# Altium schematic sheet 34.SchDoc
size 513 x 386 mm
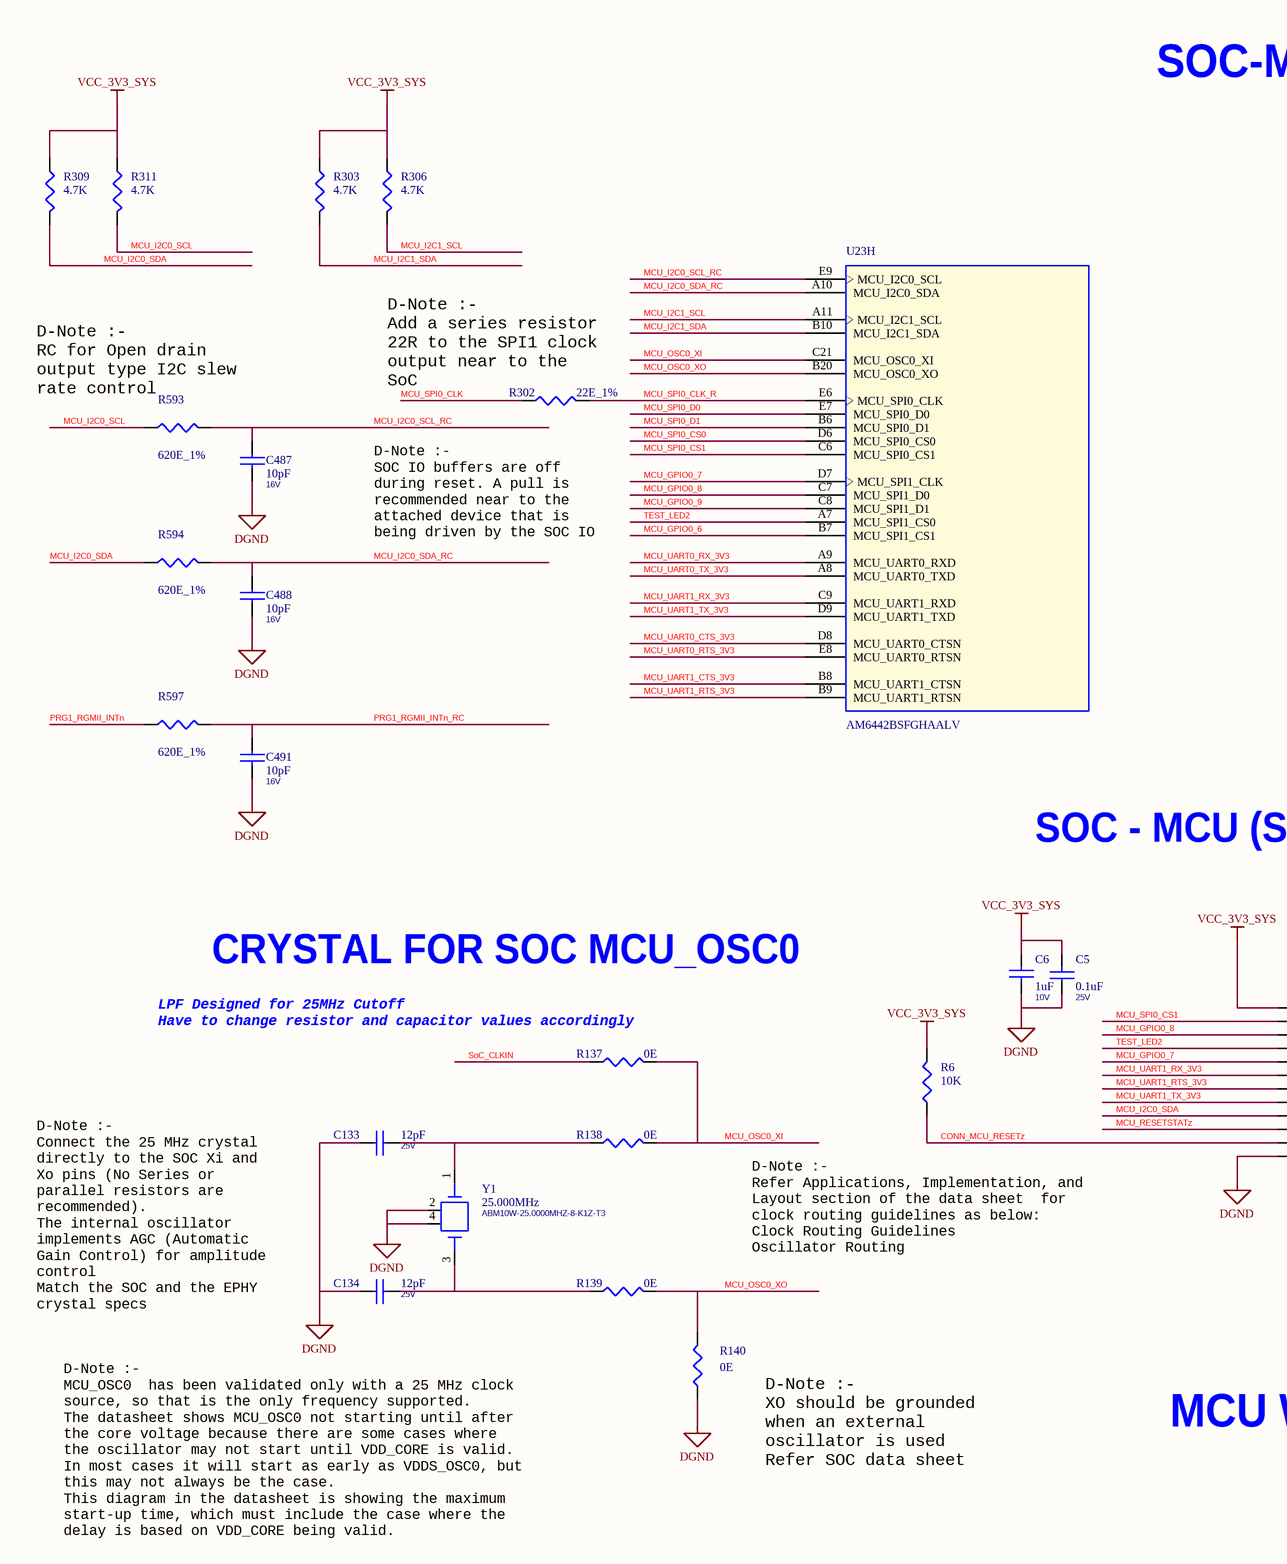
[diagram p0: 34.SchDoc, top left]
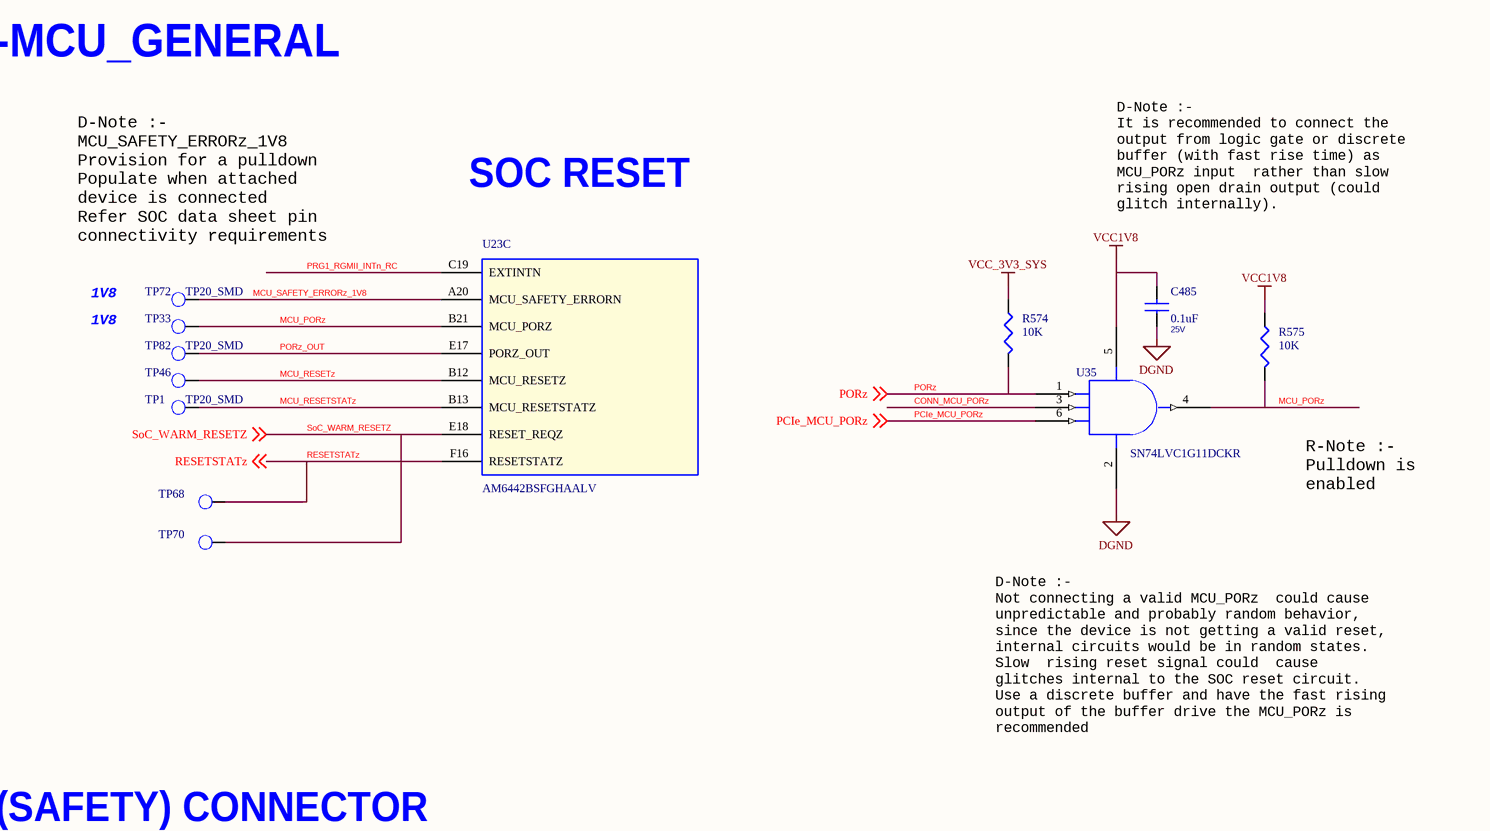
[diagram p1: 34.SchDoc, top right]
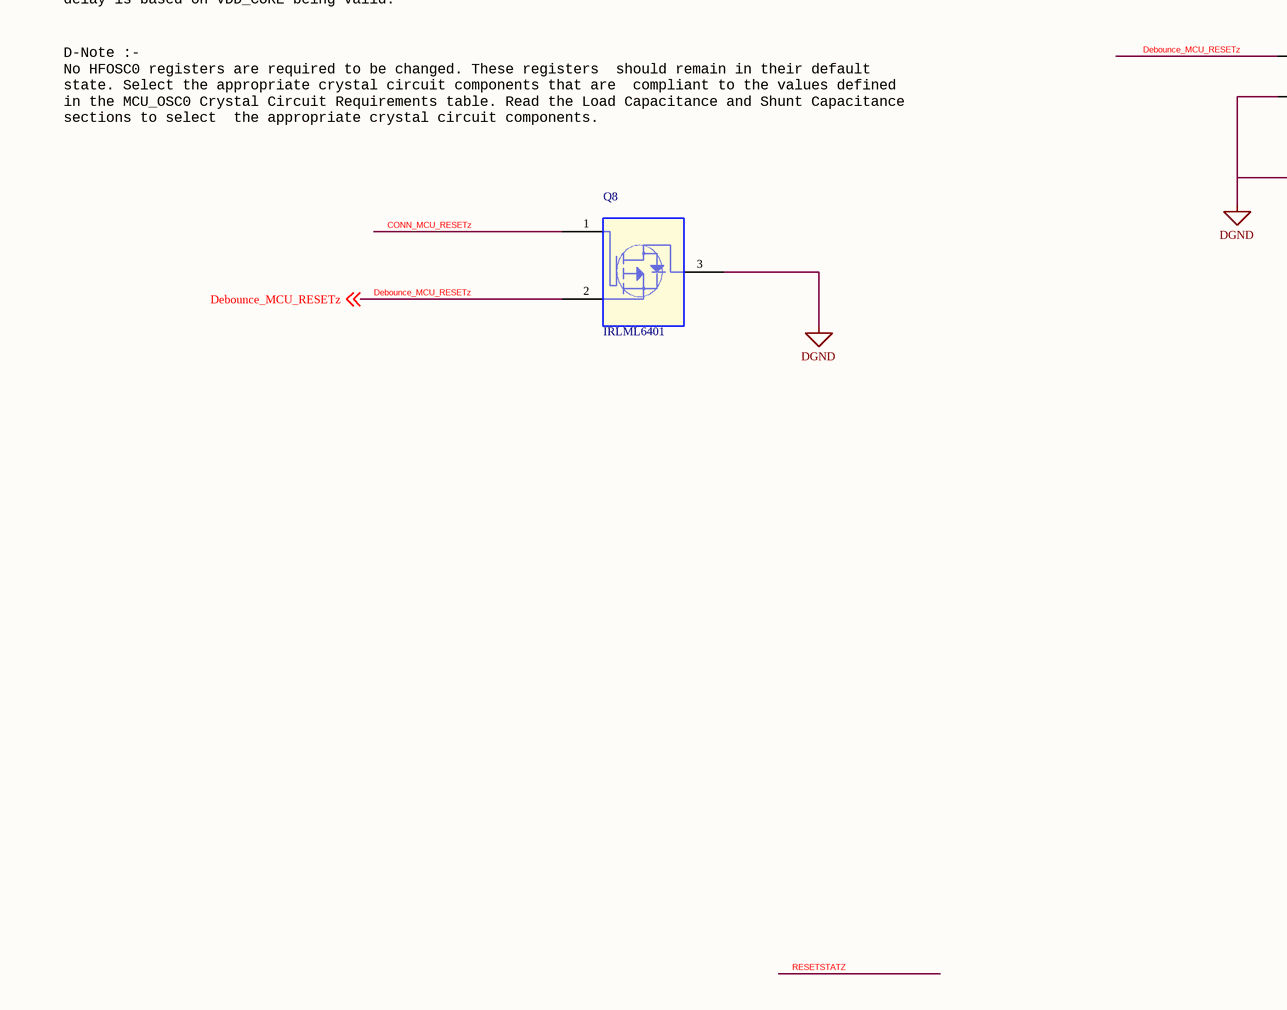
[diagram p2: 34.SchDoc, bottom left]
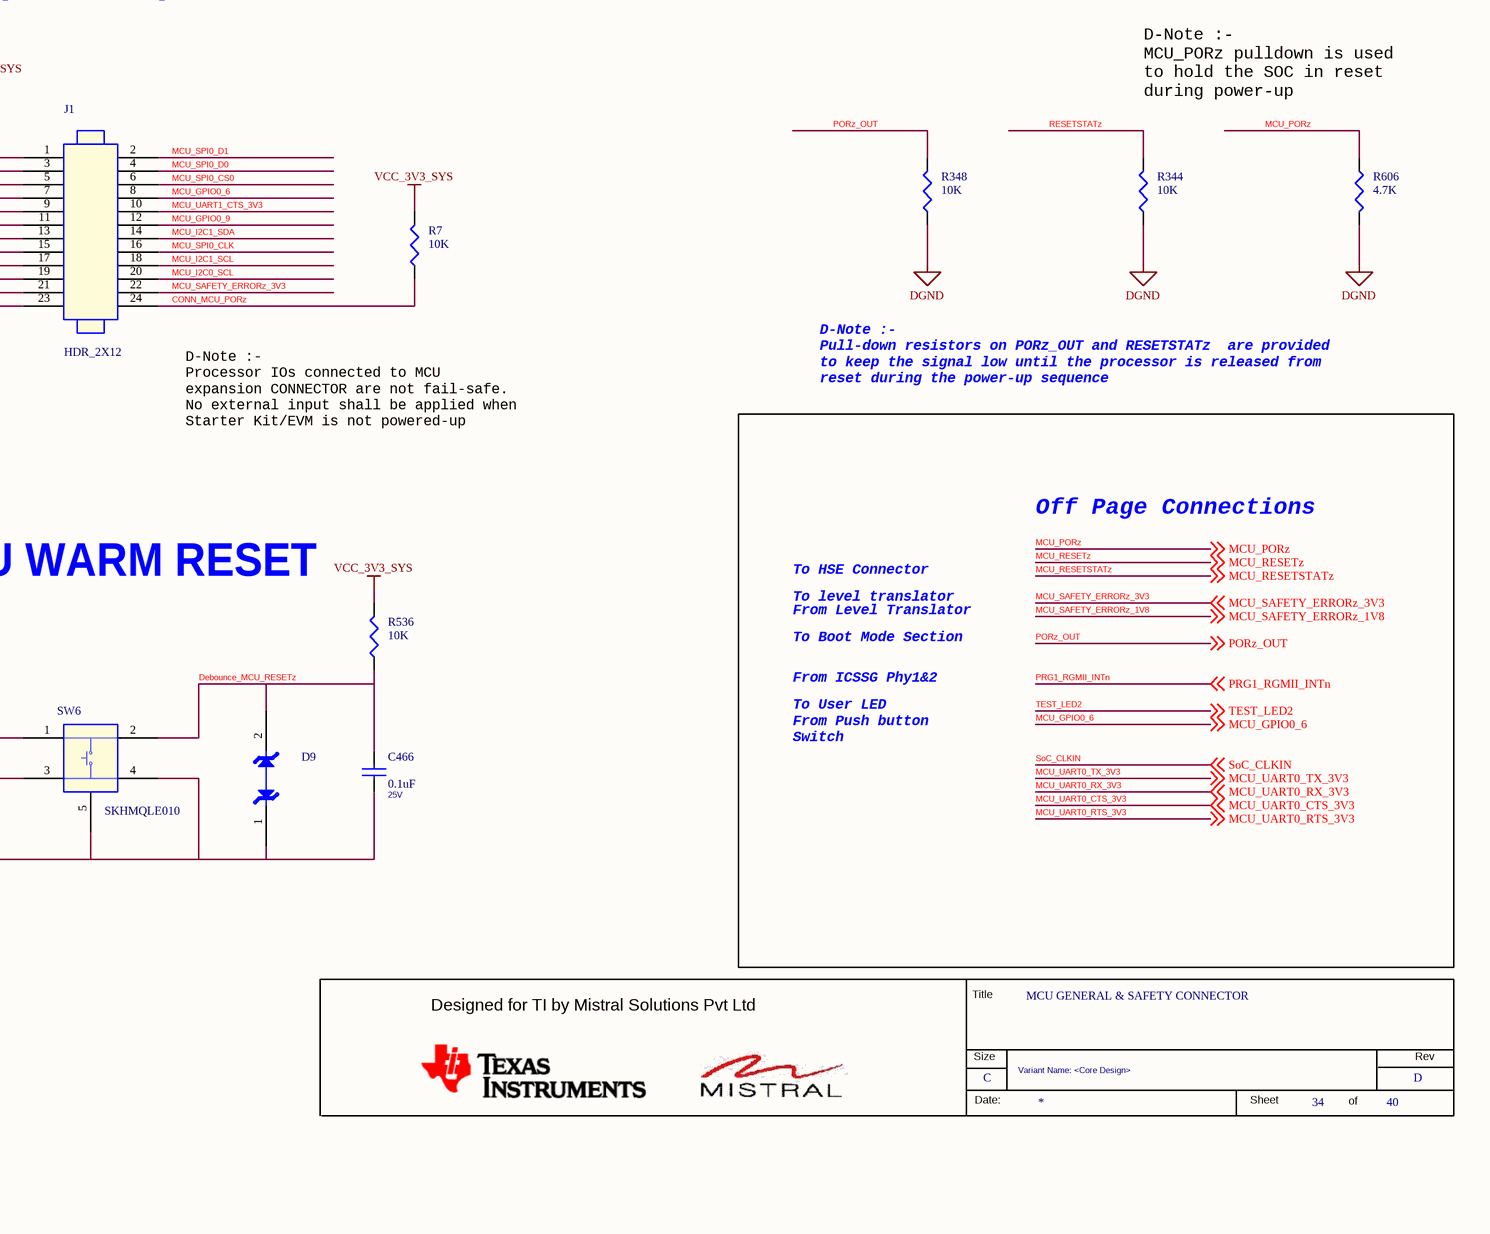
[diagram p3: 34.SchDoc, bottom right]

## Parts
*  RevCode: D  Title: MCU GENERAL & SAFETY CONNECTOR  Page Size: C  Page Number: 34  Page Count: 40  Variant Name: <Core Design>  (hidden comment: MISTRAL_TITLEBLK_CSIZE)  (graphical)
C5  0.1uF  Voltage: 25V  [CAP0402_0-75]
C6  1uF  Voltage: 10V  [CAP0402_0-75]
C133  12pF  Voltage: 25V  [CAP0201_0-5]
C134  12pF  Voltage: 25V  [CAP0201_0-5]
C466  0.1uF  Voltage: 25V  [CAP0402_0-75]
C485  0.1uF  Voltage: 25V  [CAP0402_0-75]
C487  10pF  Voltage: 16V  [CAP0402_0-75]
C488  10pF  Voltage: 16V  [CAP0402_0-75]
C491  10pF  Voltage: 16V  [CAP0402_0-75]
D9  TPD1E10B06DPYR  [DIO_DFN0402_0-5]  (value not drawn)
J1  HDR_2X12  [HDR_2X12_TSW-112-07-D_S_T_8-6]
Q8  IRLML6401  [TO_SOT23-123]
R6  10K  [RES0402_0-5]
R7  10K  [RES0402_0-5]
R137  0E  [RES0402_0-5]
R138  0E  [RES0402_0-5]
R139  0E  [RES0402_0-5]
R140  0E  [RES0402_0-5]
R302  22E_1%  [RES0402_0-5]
R303  4.7K  [RES0402_0-5]
R306  4.7K  [RES0402_0-5]
R309  4.7K  [RES0402_0-5]
R311  4.7K  [RES0402_0-5]
R344  10K  [RES0402_0-5]
R348  10K  [RES0402_0-5]
R536  10K  [RES0402_0-5]
R574  10K  [RES0402_0-5]
R575  10K  [RES0402_0-5]
R593  620E_1%  [RES0402_0-5]
R594  620E_1%  [RES0402_0-5]
R597  620E_1%  [RES0402_0-5]
R606  4.7K  [RES0402_0-5]
SW6  SKHMQLE010  [SW4_SKHMQLE010_240X260_SMD_3-1]
TP1  TP20_SMD  [TP20_SMD]
TP33  TP20_SMD  [TP20_SMD]  (value not drawn)
TP46  TP20_SMD  [TP20_SMD]  (value not drawn)
TP68  TP20_SMD  [TP20_SMD]  (value not drawn)
TP70  TP20_SMD  [TP20_SMD]  (value not drawn)
TP72  TP20_SMD  [TP20_SMD]
TP82  TP20_SMD  [TP20_SMD]
U23  AM6442BSFGHAALV  [FCBGA441_31-49_680X680_2-6]  (parts C,H of 16)
U35  SN74LVC1G11DCKR  [SC70-6]
Y1  25.000MHz  Mfr_part_number: ABM10W-25.0000MHZ-8-K1Z-T3  [XTAL4_ABM10W_100X80_SMD_0-6]

## Nets
DGND: C5.1 C6.2 C133.1 C134.1 C466.1 C485.1 C487.2 C488.2 C491.2 D9.1 J1.23 Q8.3(D) R140.1 R344.1 R348.1 R606.2 SW6.3 SW6.4 SW6.5(GND) U35.2(GND) Y1.2(GND1) Y1.4(GND2)
VCC1V8: C485.2 R575.1 U35.5(VCC)
VCC_3V3_SYS: C5.2 C6.1 J1.1 R6.2 R7.2 R303.1 R306.1 R309.1 R311.1 R536.2 R574.1
CONN_MCU_PORz: J1.24 R7.1 U35.3(B)
CONN_MCU_RESETz: J1.21 Q8.1(G) R6.1
Debounce_MCU_RESETz: C466.2 D9.2 Q8.2(S) R536.1 SW6.1 SW6.2 ; off-sheet Debounce_MCU_RESETz
MCU_GPIO0_6: J1.8 U23.B7(MCU_SPI1_CS1) ; off-sheet MCU_GPIO0_6
MCU_GPIO0_7: J1.9 U23.D7(MCU_SPI1_CLK)
MCU_GPIO0_8: J1.5 U23.C7(MCU_SPI1_D0)
MCU_GPIO0_9: J1.12 U23.C8(MCU_SPI1_D1)
MCU_I2C0_SCL: J1.20 R311.2 R593.1
MCU_I2C0_SCL_RC: C487.1 R593.2 U23.E9(MCU_I2C0_SCL)
MCU_I2C0_SDA: J1.17 R309.2 R594.1
MCU_I2C0_SDA_RC: C488.1 R594.2 U23.A10(MCU_I2C0_SDA)
MCU_I2C1_SCL: J1.18 R306.2 U23.A11(MCU_I2C1_SCL)
MCU_I2C1_SDA: J1.14 R303.2 U23.B10(MCU_I2C1_SDA)
MCU_OSC0_XI: R137.2 R138.2 U23.C21(MCU_OSC0_XI)
MCU_OSC0_XO: R139.2 R140.2 U23.B20(MCU_OSC0_XO)
MCU_PORz: R575.2 R606.1 TP33.1(TP) U23.B21(MCU_PORZ) U35.4(Y) ; off-sheet MCU_PORz
MCU_RESETSTATz: J1.19 TP1.1(TP) U23.B13(MCU_RESETSTATZ) ; off-sheet MCU_RESETSTATz
MCU_RESETz: TP46.1(TP) U23.B12(MCU_RESETZ) ; off-sheet MCU_RESETz
MCU_SAFETY_ERRORz_1V8: TP72.1(TP) U23.A20(MCU_SAFETY_ERRORN) ; off-sheet MCU_SAFETY_ERRORz_1V8
MCU_SAFETY_ERRORz_3V3: J1.22 ; off-sheet MCU_SAFETY_ERRORz_3V3
MCU_SPI0_CLK: J1.16 R302.1
MCU_SPI0_CLK_R: R302.2 U23.E6(MCU_SPI0_CLK)
MCU_SPI0_CS0: J1.6 U23.D6(MCU_SPI0_CS0)
MCU_SPI0_CS1: J1.3 U23.C6(MCU_SPI0_CS1)
MCU_SPI0_D0: J1.4 U23.E7(MCU_SPI0_D0)
MCU_SPI0_D1: J1.2 U23.B6(MCU_SPI0_D1)
MCU_UART0_CTS_3V3: U23.D8(MCU_UART0_CTSN) ; off-sheet MCU_UART0_CTS_3V3
MCU_UART0_RTS_3V3: U23.E8(MCU_UART0_RTSN) ; off-sheet MCU_UART0_RTS_3V3
MCU_UART0_RX_3V3: U23.A9(MCU_UART0_RXD) ; off-sheet MCU_UART0_RX_3V3
MCU_UART0_TX_3V3: U23.A8(MCU_UART0_TXD) ; off-sheet MCU_UART0_TX_3V3
MCU_UART1_CTS_3V3: J1.10 U23.B8(MCU_UART1_CTSN)
MCU_UART1_RTS_3V3: J1.13 U23.B9(MCU_UART1_RTSN)
MCU_UART1_RX_3V3: J1.11 U23.C9(MCU_UART1_RXD)
MCU_UART1_TX_3V3: J1.15 U23.D9(MCU_UART1_TXD)
PCIe_MCU_PORz: U35.6(C) ; off-sheet PCIe_MCU_PORz
PORz: R574.2 U35.1(A) ; off-sheet PORz
PORz_OUT: R348.2 TP82.1(TP) U23.E17(PORZ_OUT) ; off-sheet PORz_OUT
PRG1_RGMII_INTn: R597.1 ; off-sheet PRG1_RGMII_INTn
PRG1_RGMII_INTn_RC: C491.1 R597.2 U23.C19(EXTINTN)
RESETSTATZ: R344.2 TP68.1(TP) U23.F16(RESETSTATZ) ; off-sheet RESETSTATz
SoC_CLKIN: R137.1 ; off-sheet SoC_CLKIN
SoC_WARM_RESETZ: TP70.1(TP) U23.E18(RESET_REQZ) ; off-sheet SoC_WARM_RESETZ
TEST_LED2: J1.7 U23.A7(MCU_SPI1_CS0) ; off-sheet TEST_LED2
NetC133_2: C133.2 R138.1 Y1.1
NetC134_2: C134.2 R139.1 Y1.3

## Notes on the sheet
- SOC-MCU_GENERAL
- D-Note :-
  It is recommended to connect the
  output from logic gate or discrete
  buffer (with fast rise time) as
  MCU_PORz input  rather than slow
  rising open drain output (could
  glitch internally).
- D-Note :-
  MCU_SAFETY_ERRORz_1V8
  Provision for a pulldown
  Populate when attached
  device is connected
  Refer SOC data sheet pin
  connectivity requirements
- SOC RESET
- (near R593) D-Note :-
  RC for Open drain
  output type I2C slew
  rate control
- (near R302) D-Note :-
  Add a series resistor
  22R to the SPI1 clock
  output near to the
  SoC
- 1V8
- (near R302) D-Note :-
  SOC IO buffers are off
  during reset. A pull is
  recommended near to the
  attached device that is
  being driven by the SOC IO
- R-Note :-
  Pulldown is
  enabled
- D-Note :-
  Not connecting a valid MCU_PORz  could cause
  unpredictable and probably random behavior,
  since the device is not getting a valid reset,
  internal circuits would be in random states.
  Slow  rising reset signal could  cause
  glitches internal to the SOC reset circuit.
  Use a discrete buffer and have the fast rising
  output of the buffer drive the MCU_PORz is
  recommended
- SOC - MCU (SAFETY) CONNECTOR
- D-Note :-
  MCU_PORz pulldown is used
  to hold the SOC in reset
  during power-up
- (near R137) LPF Designed for 25MHz Cutoff
  Have to change resistor and capacitor values accordingly
- CRYSTAL FOR SOC MCU_OSC0
- D-Note :-
  Connect the 25 MHz crystal
  directly to the SOC Xi and
  Xo pins (No Series or
  parallel resistors are
  recommended).
  The internal oscillator
  implements AGC (Automatic
  Gain Control) for amplitude
  control
  Match the SOC and the EPHY
  crystal specs
- D-Note :-
  Refer Applications, Implementation, and
  Layout section of the data sheet  for
  clock routing guidelines as below:
  Clock Routing Guidelines
  Oscillator Routing
- D-Note :-
  Processor IOs connected to MCU
  expansion CONNECTOR are not fail-safe.
  No external input shall be applied when
  Starter Kit/EVM is not powered-up
- D-Note :-
  Pull-down resistors on PORz_OUT and RESETSTATz  are provided
  to keep the signal low until the processor is released from
  reset during the power-up sequence
- D-Note :-
  MCU_OSC0  has been validated only with a 25 MHz clock
  source, so that is the only frequency supported.
  The datasheet shows MCU_OSC0 not starting until after
  the core voltage because there are some cases where
  the oscillator may not start until VDD_CORE is valid.
  In most cases it will start as early as VDDS_OSC0, but
  this may not always be the case.
  This diagram in the datasheet is showing the maximum
  start-up time, which must include the case where the
  delay is based on VDD_CORE being valid.
- D-Note :-
  XO should be grounded
  when an external
  oscillator is used
  Refer SOC data sheet
- Off Page Connections
- MCU WARM RESET
- To HSE Connector
- To level translator
- From Level Translator
- To Boot Mode Section
- From ICSSG Phy1&2
- D-Note :-
  No HFOSC0 registers are required to be changed. These registers  should remain in their default
  state. Select the appropriate crystal circuit components that are  compliant to the values defined
  in the MCU_OSC0 Crystal Circuit Requirements table. Read the Load Capacitance and Shunt Capacitance
  sections to select  the appropriate crystal circuit components.
- To User LED
- From Push button
  Switch
- (in symbol MISTRAL_TITLEBLK_CSIZE) Title; Designed for TI by Mistral Solutions Pvt Ltd; Size; Rev; Date:; Sheet; of

## Library data of the parts
* = MISTRAL_TITLEBLK_CSIZE: Issue: 1.0; Page Create Date: March  8, 1995; Page Modify Date: *
C5 = CAP_Dup3: CAP CERAMIC 0.1uF 25V 20% X5R 0402; Alt_Mfr_name: YAGEO AMERICA; Part_type: CAPACITORS\CERAMIC; Mfr_part_number: 885012105018; Mfr_name: WURTH ELECTRONICS; Mistral Part No: 120020080003-R; Alt_Mfr_part_number: CC0402KRX5R8BB104; Custom_Duty: 15%; Customs_HS_Code: 85322990; Wattage: NA; Project: AM64x_EVM_BRD; Footprint Path: Y:\MIS_DATABASE\Library\ALTIUM_TOOL\PCB_FOOTPRINTS\Altium_Footprint_Lib.PcbLib; Library Path: Y:\MIS_DATABASE\Library\ALTIUM_TOOL\SCHEMATICS_PARTS\MS_DISCRETE_Library.schlib; Footprint Ref: CAP0402_0-75; Library Ref: CAP; MECHANICAL 3D STEP FILE: CAP0402_0-75; Chkd/date: MANIRAJA/170820; Crtd /date: ALVY/170820; Datasheet: Y:\MIS_DATABASE\DATASHEETS\CAPACITORS\885012105018.PDF; Temperature: -55癈+85癈; Weight: 0.65mg; Height: 0.55MM; Distributor_part_number: 732-7495-1-ND; Distributor_name: DIGIKEY; Package: 0402; Tolerance: 20%; PCB Footprint: CAP0402_0-75
C6 = CAP_Dup3: CAP CERAMIC 1uF 10V 20% X5R 0402; Part_type: CAPACITORS\CERAMIC; Mfr_part_number: 885012105012; Mfr_name: WURTH ELECTRONICS; Mistral Part No: 120020080009-R; Wattage: NA; Custom_Duty: 15%; Customs_HS_Code: 85322990; Project: AM64x_EVM_BRD; Footprint Ref: CAP0402_0-75; Library Ref: CAP; Footprint Path: Y:\MIS_DATABASE\Library\ALTIUM_TOOL\PCB_FOOTPRINTS\Altium_Footprint_Lib.PcbLib; Library Path: Y:\MIS_DATABASE\Library\ALTIUM_TOOL\SCHEMATICS_PARTS\MS_DISCRETE_Library.schlib; MECHANICAL 3D STEP FILE: CAP0402_0-75; Chkd/date: MANIRAJA/210820; Crtd /date: ALVY/190820; Datasheet: Y:\MIS_DATABASE\DATASHEETS\CAPACITORS\885012105012.PDF; Temperature: -55癈+85癈; Weight: 0.65mg; Height: 0.55MM; Distributor_part_number: 732-7489-1-ND; Distributor_name: DIGIKEY; Package: 0402; Tolerance: 20%; PCB Footprint: CAP0402_0-75
C133 = CAP_Dup3: CAP CERAMIC 12pF 25V 5% C0G(NP0) 0201; Part_type: CAPACITORS\CERAMIC; Mfr_part_number: GRM0335C1E120JA01D; Mfr_name: MURATA; Mistral Part No: 120009030213-R; Custom_Duty: 15%; Customs_HS_Code: 85322990; Wattage: NA; Project: QCS610_NANOSOM; PCB Footprint: CAP0201_0-5; Footprint Path: Y:\MIS_DATABASE\Library\ALTIUM_TOOL\PCB_FOOTPRINTS\Altium_Footprint_Lib.PcbLib; Library Path: Y:\MIS_DATABASE\Library\ALTIUM_TOOL\SCHEMATICS_PARTS\MS_DISCRETE_Library.schlib; MECHANICAL 3D STEP FILE: CAP0201_0-5; Chkd/date: MANIRAJA/020620; Crtd /date: ALVY/300520; Datasheet: Y:\MIS_DATABASE\DATASHEETS\CAPACITORS\GRM0335C1E120JA01.PDF; Temperature: -55癈+125癈; Weight: 0.33mg; Height: 0.33MM; Library Ref: CAP; Distributor_part_number: 490-3144-1-ND; Distributor_name: DIGIKEY; Package: 0201; Tolerance: 5%; Footprint Ref: CAP0201_0-5
C134 = CAP_Dup3: CAP CERAMIC 12pF 25V 5% C0G(NP0) 0201; Mistral Part No: 120009030213-R; Mfr_name: MURATA; Mfr_part_number: GRM0335C1E120JA01D; Part_type: CAPACITORS\CERAMIC; Project: QCS610_NANOSOM; Wattage: NA; Customs_HS_Code: 85322990; Custom_Duty: 15%; PCB Footprint: CAP0201_0-5; Footprint Ref: CAP0201_0-5; Tolerance: 5%; Package: 0201; Distributor_name: DIGIKEY; Distributor_part_number: 490-3144-1-ND; Library Ref: CAP; Height: 0.33MM; Weight: 0.33mg; Temperature: -55癈+125癈; Datasheet: Y:\MIS_DATABASE\DATASHEETS\CAPACITORS\GRM0335C1E120JA01.PDF; Crtd /date: ALVY/300520; Chkd/date: MANIRAJA/020620; MECHANICAL 3D STEP FILE: CAP0201_0-5; Library Path: Y:\MIS_DATABASE\Library\ALTIUM_TOOL\SCHEMATICS_PARTS\MS_DISCRETE_Library.schlib; Footprint Path: Y:\MIS_DATABASE\Library\ALTIUM_TOOL\PCB_FOOTPRINTS\Altium_Footprint_Lib.PcbLib
C466 C485 = CAP_Dup3: CAP CERAMIC 0.1uF 25V 20% X5R 0402; Alt_Mfr_part_number: CC0402KRX5R8BB104; Mistral Part No: 120020080003-R; Mfr_name: WURTH ELECTRONICS; Mfr_part_number: 885012105018; Part_type: CAPACITORS\CERAMIC; Alt_Mfr_name: YAGEO AMERICA; Project: AM64x_EVM_BRD; Wattage: NA; Customs_HS_Code: 85322990; Custom_Duty: 15%; Tolerance: 20%; Package: 0402; Distributor_name: DIGIKEY; Distributor_part_number: 732-7495-1-ND; Height: 0.55MM; Weight: 0.65mg; Temperature: -55癈+85癈; Datasheet: Y:\MIS_DATABASE\DATASHEETS\CAPACITORS\885012105018.PDF; Crtd /date: ALVY/170820; Chkd/date: MANIRAJA/170820; MECHANICAL 3D STEP FILE: CAP0402_0-75; Library Ref: CAP; Footprint Ref: CAP0402_0-75; Library Path: Y:\MIS_DATABASE\Library\ALTIUM_TOOL\SCHEMATICS_PARTS\MS_DISCRETE_Library.schlib; Footprint Path: Y:\MIS_DATABASE\Library\ALTIUM_TOOL\PCB_FOOTPRINTS\Altium_Footprint_Lib.PcbLib; PCB Footprint: CAP0402_0-75
C487 C488 C491 = CAP_Dup3: CAP CERAMIC 10pF 16V 5% C0G(NP0) 0402; Mistral Part No: 120018030015-R; Mfr_name: WURTH ELECTRONICS; Mfr_part_number: 885012005025; Part_type: CAPACITORS\CERAMIC; Project: SMART-M_SCRIPTALK_PB; Wattage: NA; Customs_HS_Code: 85322990; Custom_Duty: 15%; Footprint Ref: CAP0402_0-75; Tolerance: 5%; Package: 0402; Distributor_name: DIGIKEY; Distributor_part_number: 732-7441-1-ND; Library Ref: CAP; Height: 0.55MM; Weight: 0.65mg; Temperature: -55癈+125癈; Datasheet: Y:\MIS_DATABASE\DATASHEETS\CAPACITORS\885012005025.PDF; Crtd /date: ALVY/100918; Chkd/date: MANIRAJA/100918; MECHANICAL 3D STEP FILE: CAP0402_0-75; Library Path: Y:\MIS_DATABASE\Library\ALTIUM_TOOL\SCHEMATICS_PARTS\MS_DISCRETE_Library.schlib; Footprint Path: Y:\MIS_DATABASE\Library\ALTIUM_TOOL\PCB_FOOTPRINTS\Altium_Footprint_Lib.PcbLib; PCB Footprint: CAP0402_0-75
D9 = DIODE_SOD323: DIODE 1CH ESD PROTECTION X1SON2; Mistral Part No: 130014110022-R; Mfr_name: TEXAS INSTRUMENTS; Project: GALILEO_EVM; Tolerance: NA; Customs_HS_Code: 85423100; Custom_Duty: 15%; Footprint Ref: DIO_DFN0402_0-5; Mfr_part_number: TPD1E10B06DPYR; Part_type: DIODE; Voltage: NA; Wattage: NA; Package: X1SON2; Distributor_name: DIGIKEY; Distributor_part_number: 296-30406-1-ND; Library Ref: DIODE_SOD323; Height: 0.45MM; Weight: 1mg; Temperature: -40癈+125癈; Datasheet: Y:\MIS_DATABASE\DATASHEETS\ICS\INTERFACE\TPD1E10B06-SER.PDF; Crtd /date: VASANTHA/181114; Chkd/date: MANIRAJA/040420; MECHANICAL 3D STEP FILE: DIO_DFN0402_0-5; Library Path: Y:\MIS_DATABASE\Library\ALTIUM_TOOL\SCHEMATICS_PARTS\MS_DISCRETE_Library.schlib; Footprint Path: Y:\MIS_DATABASE\Library\ALTIUM_TOOL\PCB_FOOTPRINTS\Altium_Footprint_Lib.PcbLib; PCB Footprint: DIO_DFN0402_0-5
J1 = HEADER_12X2: CON HDR 2X12 2.54MM PITCH ST TH; Mistral Part No: 150020040027-R; Mfr_name: SAMTEC; Mfr_part_number: TSW-112-07-S-D; Part_type: CONNECTOR\HEADERS; Project: AM64x-GP_EVM BRD; Tolerance: NA; Customs_HS_Code: 85369090; Custom_Duty: 24%; PCB Footprint: HDR_2X12_TSW-112-07-D_S_T_8-6; Footprint Ref: HDR_2X12_TSW-112-07-D_S_T_8-6; Voltage: NA; Wattage: NA; Package: THRU-HOLE; Distributor_name: DIGIKEY; Distributor_part_number: SAM1032-12-ND; Library Ref: HEADER_12X2; Height: 8.58MM; Weight: NA; Temperature: -55癈+125癈; Datasheet: Y:\MIS_DATABASE\DATASHEETS\CONNECTORS\SAM_TSW-SER.PDF; Crtd /date: ALVY/240420; Chkd/date: MANIRAJA/250420; MECHANICAL 3D STEP FILE: HDR_2X12_TSW-112-07-D_S_T_8-6; Library Path: Y:\MIS_DATABASE\Library\ALTIUM_TOOL\SCHEMATICS_PARTS\MS_CONNECTOR_Library.schlib; Footprint Path: Y:\MIS_DATABASE\Library\ALTIUM_TOOL\PCB_FOOTPRINTS\Altium_Footprint_Lib.PcbLib
Q8 = MOSFET_IRLML6401TR: TRANSISTOR MOSFET P-CHANNEL SOT23-3; Part_type: TRANSISTOR\MOSFET; Mfr_part_number: IRLML6401TRPBF; Mfr_name: IRF; Mistral Part No: 130009031213-P; Custom_Duty: 15%; Customs_HS_Code: 85412900; Wattage: NA; Project: G4_SVGA; PCB Footprint: TO_SOT23-123; Library Ref: MOSFET_IRLML6401TR; RoHS: Pb-Free; Chkd/date: SHREESHAIL/020206; Crtd /date: MAZHAR/040505; Datasheet: Y:\MIS_DATABASE\DATASHEETS\DISCRETES\TRANSISTORS_FETS\IRLML6401.PDF; Temperature: -55癈+150癈; Weight: NA; Height: 1.11MM; Distributor_part_number: IRLML6401PBFCT-ND; Distributor_name: DIGIKEY; Package: SOT23-3; Voltage: NA; Tolerance: NA
R6 R7 R344 R574 R575 = RESISTOR_Dup6: RES 10K 1/16W 5% 0402; Mistral Part No: 110011060021-R; Mfr_name: YAGEO AMERICA; Mfr_part_number: RC0402JR-0710KL; Part_type: RESISTORS\FIXED; Project: HSE; Voltage: NA; Customs_HS_Code: 85332119; Custom_Duty: 15%; Tolerance: 5%; Wattage: 1/16W; Package: 0402; Distributor_name: DIGIKEY; Distributor_part_number: 311-10KJRCT-ND; Height: 0.40MM; Weight: 0.65mg; Temperature: -55癈+155癈; Datasheet: Y:\MIS_DATABASE\DATASHEETS\RESISTORS\RCXXXXL-SER_MAR18.PDF; Crtd /date: MAZHAR/230805; Chkd/date: VASANTHA/061216; MECHANICAL 3D STEP FILE: RES0402_0-5; Library Ref: RESISTOR; Footprint Ref: RES0402_0-5; Library Path: Y:\MIS_DATABASE\Library\ALTIUM_TOOL\SCHEMATICS_PARTS\MS_DISCRETE_Library.schlib; Footprint Path: Y:\MIS_DATABASE\Library\ALTIUM_TOOL\PCB_FOOTPRINTS\Altium_Footprint_Lib.PcbLib; PCB Footprint: RES0402_0-5
R137-R140 = RESISTOR_Dup5: RES 0E 1/16W JUMPER 0402; Part_type: RESISTORS\FIXED; Mfr_part_number: CRCW04020000Z0ED; Mfr_name: VISHAY; Mistral Part No: 110010080019-R; Custom_Duty: 15%; Customs_HS_Code: 85332119; Voltage: NA; Project: PB_BUGBASE; PCB Footprint: RES0402_0-5; MECHANICAL 3D STEP FILE: RES0402_0-5; Chkd/date: VASANTHA/201216; Crtd /date: MUDDU/190810; Datasheet: Y:\MIS_DATABASE\DATASHEETS\RESISTORS\CRCW0603.PDF; Temperature: -55癈+155癈; Weight: 0.65mg; Height: 0.40MM; Distributor_part_number: 541-0.0JCT-ND; Distributor_name: DIGIKEY; Package: 0402; Wattage: 1/16W; Tolerance: NA; Library Ref: RESISTOR; Footprint Ref: RES0402_0-5; Library Path: Y:\MIS_DATABASE\Library\ALTIUM_TOOL\SCHEMATICS_PARTS\MS_DISCRETE_Library.schlib; Footprint Path: Y:\MIS_DATABASE\Library\ALTIUM_TOOL\PCB_FOOTPRINTS\Altium_Footprint_Lib.PcbLib
R302 = RESISTOR_Dup5: RES 22E 1/16W 1% 0402; Mistral Part No: 110009090004-R; Mfr_name: YAGEO AMERICA; Mfr_part_number: RC0402FR-0722RL; Part_type: RESISTORS\FIXED; Cust_part_number: 4700-80047E; SIGNAL_MODEL: RESISTOR_RES0402_22E_22E; Project: VMEFMCD; Voltage: NA; Customs_HS_Code: 85332119; Custom_Duty: 15%; Library Ref: RESISTOR; Tolerance: 1%; Wattage: 1/16W; Package: 0402; Distributor_name: DIGIKEY; Distributor_part_number: 311-22.0LRCT-ND; Height: 0.40MM; Weight: 0.65mg; Temperature: -55癈+155癈; Datasheet: Y:\MIS_DATABASE\DATASHEETS\RESISTORS\RCXXXXL-SER_MAR18.PDF; Crtd /date: MAZHAR/090909; Chkd/date: SUHAS/290910; Footprint Ref: RES0402_0-5; MECHANICAL 3D STEP FILE: RES0402_0-5; Library Path: Y:\MIS_DATABASE\Library\ALTIUM_TOOL\SCHEMATICS_PARTS\MS_DISCRETE_Library.schlib; Footprint Path: Y:\MIS_DATABASE\Library\ALTIUM_TOOL\PCB_FOOTPRINTS\Altium_Footprint_Lib.PcbLib; PCB Footprint: RES0402_0-5
R303 R306 R606 = RESISTOR_Dup6: RES 4.7K 1/16W 5% 0402; Mistral Part No: 110011060001-R; Mfr_name: YAGEO AMERICA; Mfr_part_number: RC0402JR-074K7L; Part_type: RESISTORS\FIXED; Project: TMDXCSK368; Voltage: NA; Customs_HS_Code: 85332119; Custom_Duty: 15%; Footprint Path: Y:\MIS_DATABASE\Library\ALTIUM_TOOL\PCB_FOOTPRINTS\Altium_Footprint_Lib.PcbLib; Library Path: Y:\MIS_DATABASE\Library\ALTIUM_TOOL\SCHEMATICS_PARTS\MS_DISCRETE_Library.schlib; MECHANICAL 3D STEP FILE: RES0402_0-5; Footprint Ref: RES0402_0-5; Library Ref: RESISTOR; Tolerance: 5%; Wattage: 1/16W; Package: 0402; Distributor_name: DIGIKEY; Distributor_part_number: 311-4.7KJRCT-ND; Height: 0.40MM; Weight: 0.65mg; Temperature: -55癈+155癈; Datasheet: Y:\MIS_DATABASE\DATASHEETS\RESISTORS\RCXXXXL-SER_MAR18.PDF; Crtd /date: VASANTHA/130516; Chkd/date: VASANTHA/130516; PCB Footprint: RES0402_0-5
R309 R311 = RESISTOR_Dup6: RES 4.7K 1/16W 5% 0402; Part_type: RESISTORS\FIXED; Mfr_part_number: RC0402JR-074K7L; Mfr_name: YAGEO AMERICA; Mistral Part No: 110011060001-R; Custom_Duty: 15%; Customs_HS_Code: 85332119; Voltage: NA; Project: TMDXCSK368; Chkd/date: VASANTHA/130516; Crtd /date: VASANTHA/130516; Datasheet: Y:\MIS_DATABASE\DATASHEETS\RESISTORS\RCXXXXL-SER_MAR18.PDF; Temperature: -55癈+155癈; Weight: 0.65mg; Height: 0.40MM; Distributor_part_number: 311-4.7KJRCT-ND; Distributor_name: DIGIKEY; Package: 0402; Wattage: 1/16W; Tolerance: 5%; Library Ref: RESISTOR; Footprint Ref: RES0402_0-5; MECHANICAL 3D STEP FILE: RES0402_0-5; Library Path: Y:\MIS_DATABASE\Library\ALTIUM_TOOL\SCHEMATICS_PARTS\MS_DISCRETE_Library.schlib; Footprint Path: Y:\MIS_DATABASE\Library\ALTIUM_TOOL\PCB_FOOTPRINTS\Altium_Footprint_Lib.PcbLib; PCB Footprint: RES0402_0-5
R348 R536 = RESISTOR_Dup6: RES 10K 1/16W 5% 0402; Part_type: RESISTORS\FIXED; Mfr_part_number: RC0402JR-0710KL; Mfr_name: YAGEO AMERICA; Mistral Part No: 110011060021-R; Custom_Duty: 15%; Customs_HS_Code: 85332119; Voltage: NA; Project: HSE; PCB Footprint: RES0402_0-5; MECHANICAL 3D STEP FILE: RES0402_0-5; Chkd/date: VASANTHA/061216; Crtd /date: MAZHAR/230805; Datasheet: Y:\MIS_DATABASE\DATASHEETS\RESISTORS\RCXXXXL-SER_MAR18.PDF; Temperature: -55癈+155癈; Weight: 0.65mg; Height: 0.40MM; Distributor_part_number: 311-10KJRCT-ND; Distributor_name: DIGIKEY; Package: 0402; Wattage: 1/16W; Tolerance: 5%; Library Ref: RESISTOR; Footprint Ref: RES0402_0-5; Library Path: Y:\MIS_DATABASE\Library\ALTIUM_TOOL\SCHEMATICS_PARTS\MS_DISCRETE_Library.schlib; Footprint Path: Y:\MIS_DATABASE\Library\ALTIUM_TOOL\PCB_FOOTPRINTS\Altium_Footprint_Lib.PcbLib
R593 R594 R597 = RESISTOR_Dup1: RES 620E 1/10W 1% 0402; Mistral Part No: 110012090013-R; Mfr_name: PANASONIC-ECG; Mfr_part_number: ERJ-2RKF6200X; Part_type: RESISTORS\FIXED; Project: ITS-CONTROLER_CARD; Voltage: NA; Customs_HS_Code: 85332119; Custom_Duty: 15%; Footprint Ref: RES0402_0-5; Tolerance: 1%; Wattage: 1/10W; Package: 0402; Distributor_name: DIGIKEY; Distributor_part_number: P620LCT-ND; Library Ref: RESISTOR; Height: 0.40MM; Weight: 0.8mg; Temperature: -55癈+155癈; Datasheet: Y:\MIS_DATABASE\DATASHEETS\RESISTORS\PAN-ERJSER_NOV17.PDF; Crtd /date: CHAITHANYA/270912; Chkd/date: USMAN/120313; MECHANICAL 3D STEP FILE: RES0402_0-5; Library Path: Y:\MIS_DATABASE\Library\ALTIUM_TOOL\SCHEMATICS_PARTS\MS_DISCRETE_Library.schlib; Footprint Path: Y:\MIS_DATABASE\Library\ALTIUM_TOOL\PCB_FOOTPRINTS\Altium_Footprint_Lib.PcbLib; PCB Footprint: RES0402_0-5
SW6 = SW4_SKHUPLE010: SWITCH TACTILE SPST ST SMD; Mistral Part No: 130017100007-R; Mfr_name: ALPS; Part_type: ELECTRO-MECHANICAL\SWITCH; Project: TI_MAXIE_CPB; Tolerance: NA; Customs_HS_Code: 85369090; Custom_Duty: 24%; Mfr_part_number: SKHMQLE010; Voltage: NA; Wattage: NA; Package: SMD; Distributor_name: MOUSER; Distributor_part_number: 688-SKHMQLE010; Height: 3.10MM; Weight: NA; Temperature: -30癈+85癈; Datasheet: Y:\MIS_DATABASE\DATASHEETS\MISC\SWITCHES\SKHMQLE010.PDF; Crtd /date: MANIRAJA/051017; Chkd/date: MANIRAJA/051017; MECHANICAL 3D STEP FILE: SW4_SKHMQLE010_240X260_SMD_3-1; Library Ref: SW4_SKHUPLE010; PCB Footprint: SW4_SKHMQLE010_240X260_SMD_3-1
TP1 TP82 = TESTPOINT: TESTPOINT CIR 20 SMD; Mistral Part No: NA; Mfr_name: LOCAL; Project: BT MODULE_CSRBC04; PCB Footprint: TP20_SMD; Mfr_part_number: TP20_SMD; Part_type: TESTPOINT; Package: SMD; Distributor_name: NA; Distributor_part_number: NA; Height: NA; Crtd /date: MAZHAR/171006; Chkd/date: SHREESHAIL/171006; Tolerance: NA; Voltage: NA; Wattage: NA; Weight: NA; Temperature: NA; Datasheet: NA; MECHANICAL 3D STEP FILE: NA; Library Path: Y:\MIS_DATABASE\Library\ALTIUM_TOOL\SCHEMATICS_PARTS\MS_DISCRETE_Library.schlib; Footprint Path: Y:\MIS_DATABASE\Library\ALTIUM_TOOL\PCB_FOOTPRINTS\Altium_Footprint_Lib.PcbLib; Library Ref: TESTPOINT; Footprint Ref: TP20_SMD; RoHS: NA; Customs_HS_Code: NA; Custom_Duty: NA
TP33 TP46 TP68 TP70 = TESTPOINT: TESTPOINT CIR 20 SMD; Mfr_name: LOCAL; Custom_Duty: NA; Project: BT MODULE_CSRBC04; PCB Footprint: TP20_SMD; Customs_HS_Code: NA; Footprint Path: Y:\MIS_DATABASE\Library\ALTIUM_TOOL\PCB_FOOTPRINTS\Altium_Footprint_Lib.PcbLib; Library Path: Y:\MIS_DATABASE\Library\ALTIUM_TOOL\SCHEMATICS_PARTS\MS_DISCRETE_Library.schlib; MECHANICAL 3D STEP FILE: NA; Datasheet: NA; Temperature: NA; Weight: NA; Wattage: NA; Voltage: NA; Tolerance: NA; Chkd/date: SHREESHAIL/171006; Crtd /date: MAZHAR/171006; Height: NA; Distributor_part_number: NA; Distributor_name: NA; Package: SMD; Part_type: TESTPOINT; Mfr_part_number: TP20_SMD; Mistral Part No: NA; Library Ref: TESTPOINT; Footprint Ref: TP20_SMD; RoHS: NA
TP72 = TESTPOINT: TESTPOINT CIR 20 SMD; Mfr_name: LOCAL; MECHANICAL 3D STEP FILE: NA; Project: BT MODULE_CSRBC04; PCB Footprint: TP20_SMD; RoHS: NA; Footprint Ref: TP20_SMD; Library Ref: TESTPOINT; Footprint Path: Y:\MIS_DATABASE\Library\ALTIUM_TOOL\PCB_FOOTPRINTS\Altium_Footprint_Lib.PcbLib; Library Path: Y:\MIS_DATABASE\Library\ALTIUM_TOOL\SCHEMATICS_PARTS\MS_DISCRETE_Library.schlib; Datasheet: NA; Temperature: NA; Weight: NA; Wattage: NA; Voltage: NA; Tolerance: NA; Chkd/date: SHREESHAIL/171006; Crtd /date: MAZHAR/171006; Height: NA; Distributor_part_number: NA; Distributor_name: NA; Package: SMD; Part_type: TESTPOINT; Mfr_part_number: TP20_SMD; Mistral Part No: NA; Customs_HS_Code: NA; Custom_Duty: NA
U23 = XAM6442BSFGGAALV_BGA441: IC AM64x SoC MICROPROCESSOR BGA441; Mistral Part No: 141220080002; Mfr_name: TEXAS INSTRUMENTS; Part_type: ICS\DIGITAL\MICROPROCESSOR; Project: AM64x-GP_EVM BRD; Tolerance: NA; Customs_HS_Code: 85423100; Custom_Duty: 15%; PCB Footprint: FCBGA441_31-49_680X680_2-6; Footprint Ref: FCBGA441_31-49_680X680_2-6; Mfr_part_number: AM6442BSFGHAALV; Voltage: NA; Wattage: NA; Package: BGA441; Distributor_name: NA; Distributor_part_number: NA; Library Ref: XAM6442BSFGGAALV_BGA441; Height: 2.57MM; Weight: NA; Temperature: NA; Datasheet: Y:\MIS_DATABASE\DATASHEETS\ICS\DIGITAL\MICROCONTROLLER\AM64-SoC_SVB.PDF; Crtd /date: ALVY/300322; Chkd/date: ALVY/300322; RoHS: NA; MECHANICAL 3D STEP FILE: FCBGA441_31-49_680X680_2-6; Library Path: Y:\MIS_DATABASE\Library\ALTIUM_TOOL\SCHEMATICS_PARTS\MS_MICROPROCESSOR_Library.schlib; Footprint Path: Y:\MIS_DATABASE\Library\ALTIUM_TOOL\PCB_FOOTPRINTS\Altium_Footprint_Lib.PcbLib
U35 = SN74LVC1G11DCKR_SC70-6: IC SINGLE 3-INPUT POSITIVE-AND GATE SC70-6; Mistral Part No: 141009030230-R; Mfr_name: TEXAS INSTRUMENTS; Part_type: ICS\DIGITAL\GATES; Project: VOCERA; Customs_HS_Code: 85423100; Custom_Duty: 15%; PCB Footprint: SC70-6; Library Ref: SN74LVC1G11DCKR_SC70-6; Mfr_part_number: SN74LVC1G11DCKR; Package: SC70-6; Distributor_name: DIGIKEY; Distributor_part_number: 296-18066-1-ND; Height: 1.10MM; Datasheet: Y:\MIS_DATABASE\DATASHEETS\ICS\DIGITAL\GATES\SN74LVC1G.PDF; Crtd /date: MAZHAR/150506; Chkd/date: SHREESHAIL/220506; RoHS: Sb/ Br FREE
Y1 = CRY4_ABM8G: CRY 25.000MHz 8pF SMD; Mistral Part No: 130020060044-R; Mfr_name: ABRACON CORPORATION; Part_type: CRYSTAL; Project: AM64x_SVB DUT BRD; Tolerance: NA; Customs_HS_Code: 85439000; Custom_Duty: 24%; PCB Footprint: XTAL4_ABM10W_100X80_SMD_0-6; Footprint Ref: XTAL4_ABM10W_100X80_SMD_0-6; Voltage: NA; Wattage: NA; Package: SMD; Distributor_name: DIGIKEY; Distributor_part_number: 535-13736-1-ND; Library Ref: CRY4_ABM8G; Height: 0.60MM; Weight: NA; Temperature: -40癈+125癈; Datasheet: Y:\MIS_DATABASE\DATASHEETS\MISC\CRY_OSC\ABM10W.PDF; Crtd /date: ALVY/250620; Chkd/date: MANIRAJA/250620; MECHANICAL 3D STEP FILE: XTAL4_ABM10W_100X80_SMD_0-6; Library Path: Y:\MIS_DATABASE\Library\ALTIUM_TOOL\SCHEMATICS_PARTS\MS_DISCRETE_Library.schlib; Footprint Path: Y:\MIS_DATABASE\Library\ALTIUM_TOOL\PCB_FOOTPRINTS\Altium_Footprint_Lib.PcbLib